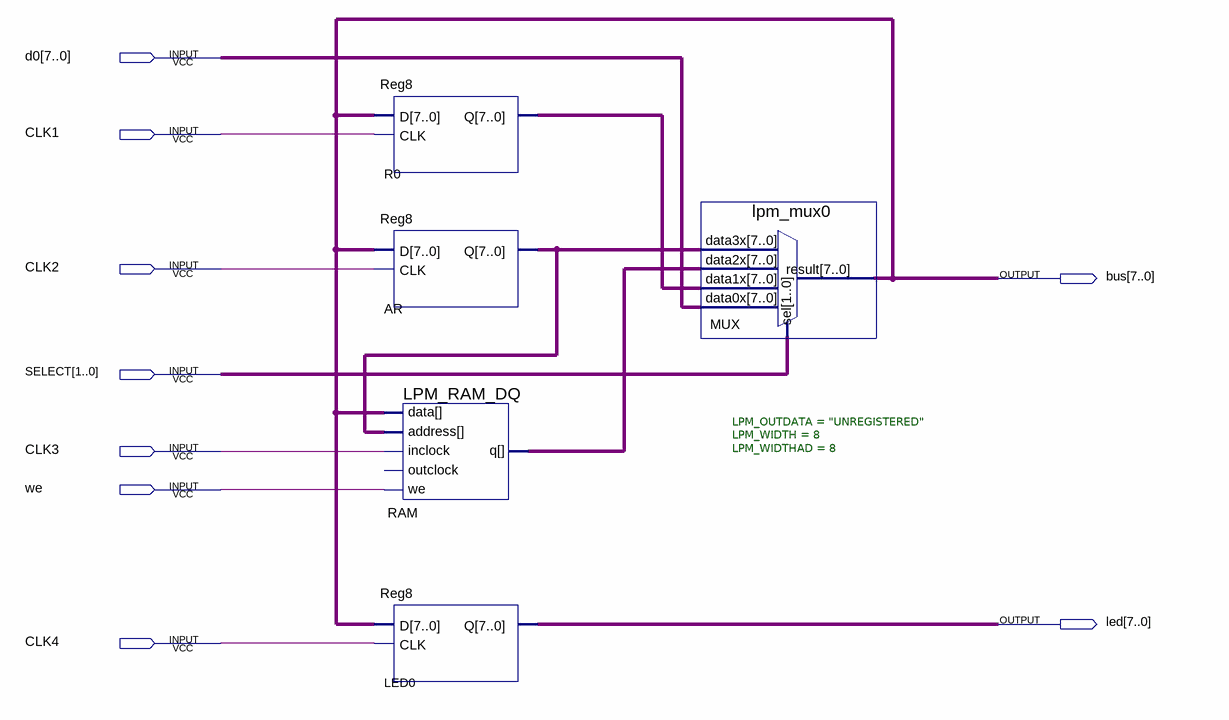
[diagram p0: schematic sheet]
// Quartus schematic bus2627.bdf as structural Verilog: 5 symbols, 9 pins
module bus2627 (
  input  [7:0] d0,
  input  CLK1,
  input  CLK2,
  input  [1:0] SELECT,
  input  CLK3,
  input  we,
  input  CLK4,
  output [7:0] bus,
  output [7:0] led
);

  wire [7:0] AR_q, R0_q, RAM_q;

  Reg8 R0 (.D(bus), .CLK(CLK1), .Q(R0_q));
  Reg8 AR (.D(bus), .CLK(CLK2), .Q(AR_q));
  LPM_RAM_DQ #(.LPM_OUTDATA("UNREGISTERED"), .LPM_WIDTH(8), .LPM_WIDTHAD(8)) RAM (
    .inclock(CLK3), .data(bus), .address(AR_q), .we(we), .q(RAM_q));  // open: outclock
  Reg8 LED0 (.D(bus), .CLK(CLK4), .Q(led));
  lpm_mux0 MUX (.data3x(AR_q), .data2x(RAM_q), .data1x(R0_q), .data0x(d0), .sel(SELECT), .result(bus));
endmodule
